# EAGLE schematic basic (EAGLE 9.5.2)
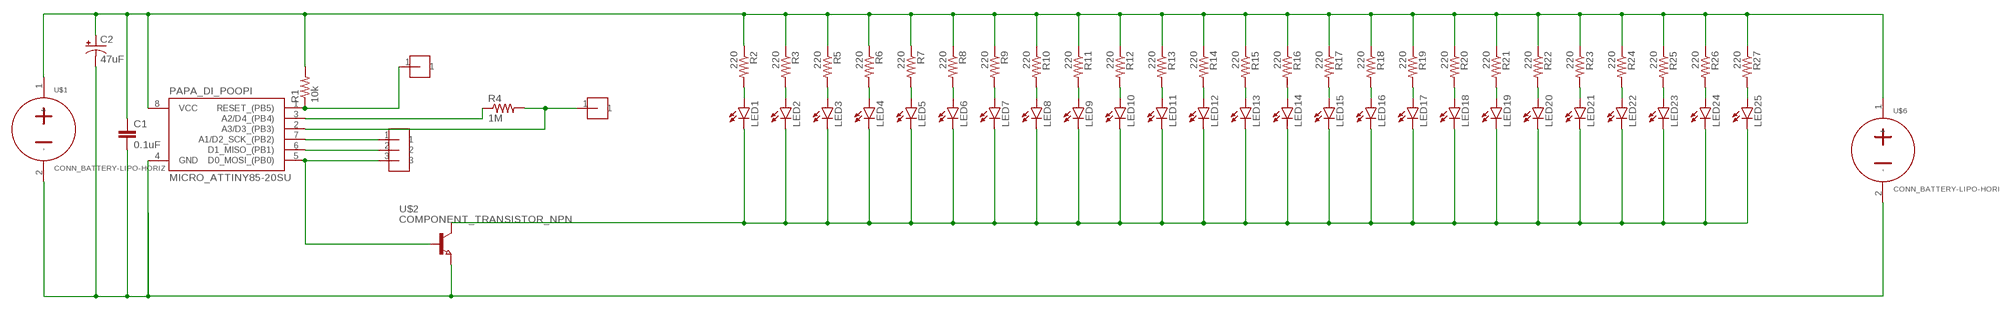
[diagram p0: schematic, sheet 1]

## Parts
C1  0.1uF  COMPONENT_CAP-0805  [0805]
C2  47uF  COMPONENT_CAP_POL-6.3MM  [CAP_RADIAL_CAN_10MM]
CAP_SENSOR_1  HEADER-1-TESTPOINT  [TESTPOINT-1]
CAP_SENSOR_2  HEADER-1-TESTPOINT  [TESTPOINT-1]
LED1  LED-0805  [CHIP-LED0805]
LED2  LED-0805  [CHIP-LED0805]
LED3  LED-0805  [CHIP-LED0805]
LED4  LED-0805  [CHIP-LED0805]
LED5  LED-0805  [CHIP-LED0805]
LED6  LED-0805  [CHIP-LED0805]
LED7  LED-0805  [CHIP-LED0805]
LED8  LED-0805  [CHIP-LED0805]
LED9  LED-0805  [CHIP-LED0805]
LED10  LED-0805  [CHIP-LED0805]
LED11  LED-0805  [CHIP-LED0805]
LED12  LED-0805  [CHIP-LED0805]
LED13  LED-0805  [CHIP-LED0805]
LED14  LED-0805  [CHIP-LED0805]
LED15  LED-0805  [CHIP-LED0805]
LED16  LED-0805  [CHIP-LED0805]
LED17  LED-0805  [CHIP-LED0805]
LED18  LED-0805  [CHIP-LED0805]
LED19  LED-0805  [CHIP-LED0805]
LED20  LED-0805  [CHIP-LED0805]
LED21  LED-0805  [CHIP-LED0805]
LED22  LED-0805  [CHIP-LED0805]
LED23  LED-0805  [CHIP-LED0805]
LED24  LED-0805  [CHIP-LED0805]
LED25  LED-0805  [CHIP-LED0805]
PAPA_DI_POOPI  MICRO_ATTINY85-20SU  [SOIC8]
R1  10k  COMPONENT_RESISTOR-0805  [0805]
R2  220  COMPONENT_RESISTOR-0805  [0805]
R3  220  COMPONENT_RESISTOR-0805  [0805]
R4  1M  COMPONENT_RESISTOR-0805  [0805]
R5  220  COMPONENT_RESISTOR-0805  [0805]
R6  220  COMPONENT_RESISTOR-0805  [0805]
R7  220  COMPONENT_RESISTOR-0805  [0805]
R8  220  COMPONENT_RESISTOR-0805  [0805]
R9  220  COMPONENT_RESISTOR-0805  [0805]
R10  220  COMPONENT_RESISTOR-0805  [0805]
R11  220  COMPONENT_RESISTOR-0805  [0805]
R12  220  COMPONENT_RESISTOR-0805  [0805]
R13  220  COMPONENT_RESISTOR-0805  [0805]
R14  220  COMPONENT_RESISTOR-0805  [0805]
R15  220  COMPONENT_RESISTOR-0805  [0805]
R16  220  COMPONENT_RESISTOR-0805  [0805]
R17  220  COMPONENT_RESISTOR-0805  [0805]
R18  220  COMPONENT_RESISTOR-0805  [0805]
R19  220  COMPONENT_RESISTOR-0805  [0805]
R20  220  COMPONENT_RESISTOR-0805  [0805]
R21  220  COMPONENT_RESISTOR-0805  [0805]
R22  220  COMPONENT_RESISTOR-0805  [0805]
R23  220  COMPONENT_RESISTOR-0805  [0805]
R24  220  COMPONENT_RESISTOR-0805  [0805]
R25  220  COMPONENT_RESISTOR-0805  [0805]
R26  220  COMPONENT_RESISTOR-0805  [0805]
R27  220  COMPONENT_RESISTOR-0805  [0805]
U$1  CONN_BATTERY-LIPO-HORIZ  [JST-PH-2-SMT-RA]
U$2  COMPONENT_TRANSISTOR_NPN  [SOT23]
U$5  HEADER-3-TESTPOINT  [TESTPOINT-3]
U$6  CONN_BATTERY-LIPO-HORIZ  [JST-PH-2-SMT-RA]

## Nets
COLLECTOR: LED1.C LED2.C LED3.C LED4.C LED5.C LED6.C LED7.C LED8.C LED9.C LED10.C LED11.C LED12.C LED13.C LED14.C LED15.C LED16.C LED17.C LED18.C LED19.C LED20.C LED21.C LED22.C LED23.C LED24.C LED25.C U$2.3(C)
N$1: CAP_SENSOR_1.1 PAPA_DI_POOPI.1(RESET_(PB5)) R1.1
N$2: LED3.A R5.2
N$3: PAPA_DI_POOPI.5(D0_MOSI_(PB0)) U$2.1(B) U$5.3
N$4: PAPA_DI_POOPI.7(A1/D2_SCK_(PB2)) U$5.1
N$5: LED1.A R2.2
N$7: LED2.A R3.2
N$8: PAPA_DI_POOPI.3(A2/D4_(PB4)) R4.1
N$9: CAP_SENSOR_2.1 PAPA_DI_POOPI.2(A3/D3_(PB3)) R4.2
N$10: C1.2 C2.- PAPA_DI_POOPI.4(GND) U$1.2(-) U$2.2(E) U$6.2(-)
N$11: PAPA_DI_POOPI.6(D1_MISO_(PB1)) U$5.2
N$17: LED4.A R6.2
N$19: LED7.A R9.2
N$20: LED5.A R7.2
N$23: LED6.A R8.2
N$24: LED8.A R10.2
N$27: LED9.A R11.2
N$30: LED10.A R12.2
N$33: LED11.A R13.2
N$36: LED12.A R14.2
N$39: LED13.A R15.2
N$42: LED14.A R16.2
N$45: LED15.A R17.2
N$48: LED16.A R18.2
N$51: LED17.A R19.2
N$54: LED18.A R20.2
N$57: LED19.A R21.2
N$60: LED20.A R22.2
N$63: LED21.A R23.2
N$66: LED22.A R24.2
N$69: LED23.A R25.2
N$72: LED24.A R26.2
N$75: LED25.A R27.2
POWER: C1.1 C2.+ PAPA_DI_POOPI.8(VCC) R1.2 R2.1 R3.1 R5.1 R6.1 R7.1 R8.1 R9.1 R10.1 R11.1 R12.1 R13.1 R14.1 R15.1 R16.1 R17.1 R18.1 R19.1 R20.1 R21.1 R22.1 R23.1 R24.1 R25.1 R26.1 R27.1 U$1.1(+) U$6.1(+)

## Library data of the parts
C1 = homemade-hardware:COMPONENT_CAP: Capacitor Standard 0603 ceramic capacitor, and 0.1" leaded capacitor.
C2 = homemade-hardware:COMPONENT_CAP_POL: Capacitor Polarized These are standard SMD and PTH capacitors. Normally 47uF, 100uF, and 470uF in electrolytic and tantalum varieties. Always verify the external diameter of the through hole cap, it varies with capacity, voltage, and manufacturer. The EIA devices should be standard.
CAP_SENSOR_1 CAP_SENSOR_2 = homemade-hardware:HEADER-1: M20-8890845 <https://www.digikey.com/products/en?keywords=952-3236-ND>: Horizontal Male SMD Headers M20-7910842R <https://www.digikey.com/product-detail/en/harwin-inc/M20-7910842R/952-3200-6-ND/6559341>: Horizontal Female SMD Headers
LED1-LED25 = homemade-hardware:LED: LEDs Standard schematic elements and footprints for 5mm, 3mm, 1206, and 0603 sized LEDs. 5mm - Spark Fun Electronics SKU : COM-00529 (and others)
PAPA_DI_POOPI = homemade-hardware:MICRO_ATTINY85
R1-R27 = homemade-hardware:COMPONENT_RESISTOR
U$1 U$6 = homemade-hardware:CONN_BATTERY
U$2 = homemade-hardware:COMPONENT_TRANSISTOR_NPN: BSS806NH6327XTSA1 <https://www.digikey.com/product-detail/en/infineon-technologies/BSS806NH6327XTSA1/BSS806NH6327XTSA1DKR-ND/3196843>: NPN Moseft Transistor - 20V 2.3A; PN: BSS806NH6327XTSA1
U$5 = homemade-hardware:HEADER-3: NPTC081KFXC-RC <https://www.digikey.com/product-detail/en/sullins-connector-solutions/NPTC081KFXC-RC/S5600-ND/776058>: Vertical Female SMD Headers TSM-110-01-T-SV <https://www.digikey.com/product-detail/en/samtec-inc/TSM-110-01-T-SV/SAM12267-ND/6691889>: Vertical Male SMD Headers M20-8890845 <https://www.digikey.com/products/en?keywords=952-3236-ND>: Horizontal Male SMD Headers M20-7910842R <https://www.digikey.com/product-detail/en/harwin-inc/M20-7910842R/952-3200-6-ND/6559341>: Horizontal Female SMD Headers